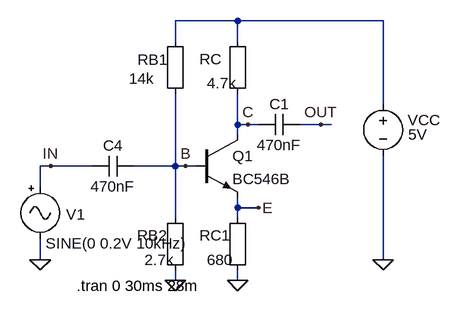
[diagram p0: schematic BJT-AMP-CLASS-A.asc]
BJT-AMP-CLASS-A.asc, the LTspice schematic file:
Version 4
SHEET 1 880 680
WIRE 192 -64 96 -64
WIRE 416 -64 192 -64
WIRE 96 -32 96 -64
WIRE 192 -32 192 -64
WIRE 416 64 416 -64
WIRE 192 96 192 48
WIRE 208 96 192 96
WIRE 224 96 208 96
WIRE 320 96 288 96
WIRE 336 96 320 96
WIRE 192 112 192 96
WIRE -96 160 -112 160
WIRE -32 160 -96 160
WIRE 96 160 96 48
WIRE 96 160 32 160
WIRE 112 160 96 160
WIRE 128 160 112 160
WIRE -112 192 -112 160
WIRE 192 224 192 208
WIRE 224 224 192 224
WIRE 96 240 96 160
WIRE 192 240 192 224
WIRE -112 304 -112 272
WIRE 416 304 416 144
WIRE 96 336 96 320
WIRE 192 336 192 320
FLAG -112 304 0
FLAG 416 304 0
FLAG -96 160 IN
FLAG 192 336 0
FLAG 96 336 0
FLAG 208 96 C
FLAG 112 160 B
FLAG 224 224 E
FLAG 320 96 OUT
SYMBOL npn 128 112 R0
SYMATTR InstName Q1
SYMATTR Value BC546B
SYMBOL Misc\\EuropeanResistor 80 -48 R0
WINDOW 0 -42 44 Left 2
WINDOW 3 -55 73 Left 2
SYMATTR InstName RB1
SYMATTR Value 14k
SYMBOL Misc\\EuropeanResistor 176 -48 R0
WINDOW 0 -43 43 Left 2
WINDOW 3 -31 80 Left 2
SYMATTR InstName RC
SYMATTR Value 4.7k
SYMBOL Misc\\signal -112 176 R0
WINDOW 123 0 0 Left 2
WINDOW 0 40 58 Left 2
WINDOW 3 8 103 Left 2
WINDOW 39 0 0 Left 0
SYMATTR InstName V1
SYMATTR Value SINE(0 0.2V 10kHz)
SYMBOL voltage 416 48 R0
WINDOW 0 38 41 Left 2
WINDOW 3 39 63 Left 2
WINDOW 123 0 0 Left 2
WINDOW 39 0 0 Left 2
SYMATTR InstName VCC
SYMATTR Value 5V
SYMBOL cap 32 144 R90
WINDOW 0 0 32 VBottom 2
WINDOW 3 32 32 VTop 2
SYMATTR InstName C4
SYMATTR Value 470nF
SYMBOL Misc\\EuropeanResistor 176 224 R0
WINDOW 0 -43 43 Left 2
WINDOW 3 -31 80 Left 2
SYMATTR InstName RC1
SYMATTR Value 680
SYMBOL Misc\\EuropeanResistor 80 224 R0
WINDOW 0 -43 43 Left 2
WINDOW 3 -31 80 Left 2
SYMATTR InstName RB2
SYMATTR Value 2.7k
SYMBOL cap 288 80 R90
WINDOW 0 0 32 VBottom 2
WINDOW 3 32 32 VTop 2
SYMATTR InstName C1
SYMATTR Value 470nF
TEXT -56 344 Left 2 !.tran 0 30ms 28m

The netlist it stands for:
* BJT-AMP-CLASS-A.asc
Q1 C B E 0 BC546B
RB1 N001 B 14k
RC N001 C 4.7k
V1 IN 0 SINE(0 0.2V 10kHz)
VCC N001 0 5V
C4 B IN 470nF
RC1 E 0 680
RB2 B 0 2.7k
C1 OUT C 470nF
.model NPN NPN
.model PNP PNP
.lib standard.bjt
.tran 0 30ms 28m
.backanno
.end